# Altium project MultiPowerV2.PrjPcb
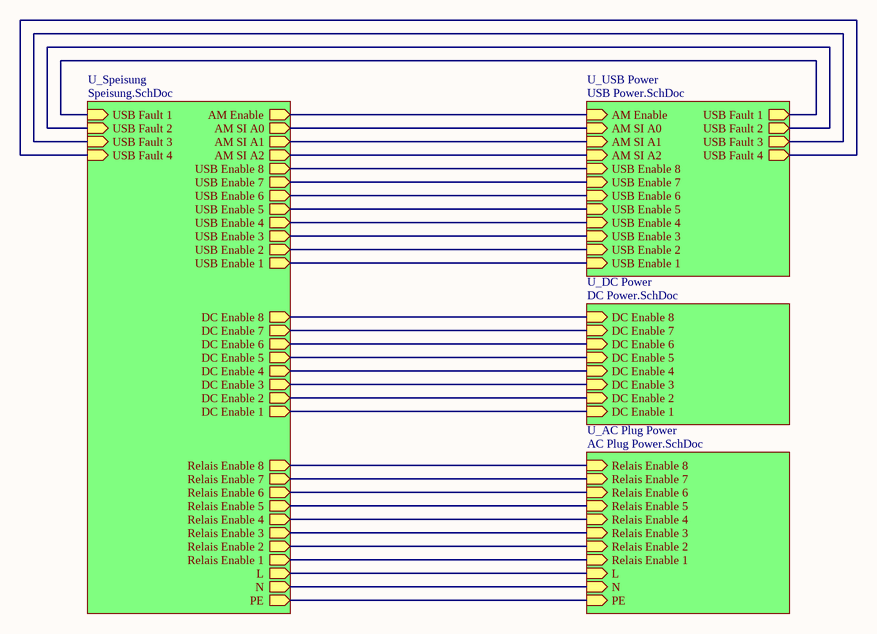
[diagram p0: Main.SchDoc]
5 sheets, 178 parts. Net scope: hierarchical (ports join the sheet entries above them; power ports are global).
Board file: MultiPower.PcbDoc
Sheets:
  Main.SchDoc
    U_Speisung = Speisung.SchDoc
    U_USB Power = USB Power.SchDoc
    U_DC Power = DC Power.SchDoc
    U_AC Plug Power = AC Plug Power.SchDoc

## Sheet Main.SchDoc
size A4; SheetNumber: 1; SheetTotal: 5

### Sub-sheets
U_AC Plug Power = AC Plug Power.SchDoc: Relais Enable 1 (in), Relais Enable 2 (in), Relais Enable 4 (in), Relais Enable 6 (in), Relais Enable 8 (in), Relais Enable 7 (in), Relais Enable 5 (in), Relais Enable 3 (in), L (in), N (in), PE (in)
U_DC Power = DC Power.SchDoc: DC Enable 5 (in), DC Enable 1 (in), DC Enable 2 (in), DC Enable 3 (in), DC Enable 4 (in), DC Enable 6 (in), DC Enable 7 (in), DC Enable 8 (in)
U_Speisung = Speisung.SchDoc: N (out), L (out), PE (out), DC Enable 8 (out), DC Enable 7 (out), DC Enable 6 (out), DC Enable 5 (out), DC Enable 4 (out), DC Enable 3 (out), DC Enable 2 (out), DC Enable 1 (out), Relais Enable 8 (out), Relais Enable 7 (out), Relais Enable 6 (out), Relais Enable 5 (out), Relais Enable 4 (out), Relais Enable 3 (out), Relais Enable 2 (out), Relais Enable 1 (out), USB Enable 8 (out), USB Enable 7 (out), USB Enable 6 (out), USB Enable 5 (out), USB Enable 4 (out), USB Enable 3 (out), USB Enable 2 (out), USB Enable 1 (out), USB Fault 4 (in), USB Fault 3 (in), USB Fault 2 (in), USB Fault 1 (in), AM SI A2 (out), AM SI A1 (out), AM SI A0 (out), AM Enable (out)
U_USB Power = USB Power.SchDoc: AM SI A0 (in), AM SI A1 (in), AM SI A2 (in), AM Enable (in), USB Fault 1 (out), USB Fault 3 (out), USB Fault 2 (out), USB Fault 4 (out), USB Enable 7 (in), USB Enable 3 (in), USB Enable 1 (in), USB Enable 8 (in), USB Enable 4 (in), USB Enable 2 (in), USB Enable 6 (in), USB Enable 5 (in)

### Nets
L: sheet U_Speisung/L, sheet U_AC Plug Power/L
N: sheet U_Speisung/N, sheet U_AC Plug Power/N
PE: sheet U_Speisung/PE, sheet U_AC Plug Power/PE
NetK1_4: sheet U_Speisung/USB Enable 8, sheet U_USB Power/USB Enable 8
NetK1_5: sheet U_Speisung/USB Enable 7, sheet U_USB Power/USB Enable 7
NetK1_6: sheet U_Speisung/USB Enable 6, sheet U_USB Power/USB Enable 6
NetK1_7: sheet U_Speisung/USB Enable 5, sheet U_USB Power/USB Enable 5
NetK1_8: sheet U_Speisung/USB Enable 4, sheet U_USB Power/USB Enable 4
NetK1_9: sheet U_Speisung/USB Enable 3, sheet U_USB Power/USB Enable 3
NetK1_10: sheet U_Speisung/USB Enable 2, sheet U_USB Power/USB Enable 2
NetK1_11: sheet U_Speisung/USB Enable 1, sheet U_USB Power/USB Enable 1
NetK1_13: sheet U_Speisung/USB Fault 4, sheet U_USB Power/USB Fault 4
NetK1_14: sheet U_Speisung/USB Fault 3, sheet U_USB Power/USB Fault 3
NetK1_15: sheet U_Speisung/USB Fault 2, sheet U_USB Power/USB Fault 2
NetK1_16: sheet U_Speisung/USB Fault 1, sheet U_USB Power/USB Fault 1
NetK1_17: sheet U_Speisung/AM SI A2, sheet U_USB Power/AM SI A2
NetK1_18: sheet U_Speisung/AM SI A1, sheet U_USB Power/AM SI A1
NetK1_19: sheet U_Speisung/AM SI A0, sheet U_USB Power/AM SI A0
NetK1_20: sheet U_Speisung/AM Enable, sheet U_USB Power/AM Enable
NetK2_4: sheet U_Speisung/DC Enable 8, sheet U_DC Power/DC Enable 8
NetK2_5: sheet U_Speisung/DC Enable 7, sheet U_DC Power/DC Enable 7
NetK2_6: sheet U_Speisung/DC Enable 6, sheet U_DC Power/DC Enable 6
NetK2_7: sheet U_Speisung/DC Enable 5, sheet U_DC Power/DC Enable 5
NetK2_8: sheet U_Speisung/DC Enable 4, sheet U_DC Power/DC Enable 4
NetK2_9: sheet U_Speisung/DC Enable 3, sheet U_DC Power/DC Enable 3
NetK2_10: sheet U_Speisung/DC Enable 2, sheet U_DC Power/DC Enable 2
NetK2_11: sheet U_Speisung/DC Enable 1, sheet U_DC Power/DC Enable 1
NetK2_13: sheet U_Speisung/Relais Enable 8, sheet U_AC Plug Power/Relais Enable 8
NetK2_14: sheet U_Speisung/Relais Enable 7, sheet U_AC Plug Power/Relais Enable 7
NetK2_15: sheet U_Speisung/Relais Enable 6, sheet U_AC Plug Power/Relais Enable 6
NetK2_16: sheet U_Speisung/Relais Enable 5, sheet U_AC Plug Power/Relais Enable 5
NetK2_17: sheet U_Speisung/Relais Enable 4, sheet U_AC Plug Power/Relais Enable 4
NetK2_18: sheet U_Speisung/Relais Enable 3, sheet U_AC Plug Power/Relais Enable 3
NetK2_19: sheet U_Speisung/Relais Enable 2, sheet U_AC Plug Power/Relais Enable 2
NetK2_20: sheet U_Speisung/Relais Enable 1, sheet U_AC Plug Power/Relais Enable 1

### Notes on the sheet
- Bahnhöheweg 70
- ICT Berufsbildungscenter AG
- Bereich Elektronik
- Datum:
- Version:
- Blattgrösse:
- Blattnummer:
- A4
- /
- 3018 Bern
- Dateiname:

## Sheet Speisung.SchDoc: Speisung
size A4; Author: bweina; CompanyName: ICT Bbc AG; DrawnBy: bweina; Engineer: bweina; Revision: 1.0.0; SheetNumber: 2; SheetTotal: 5
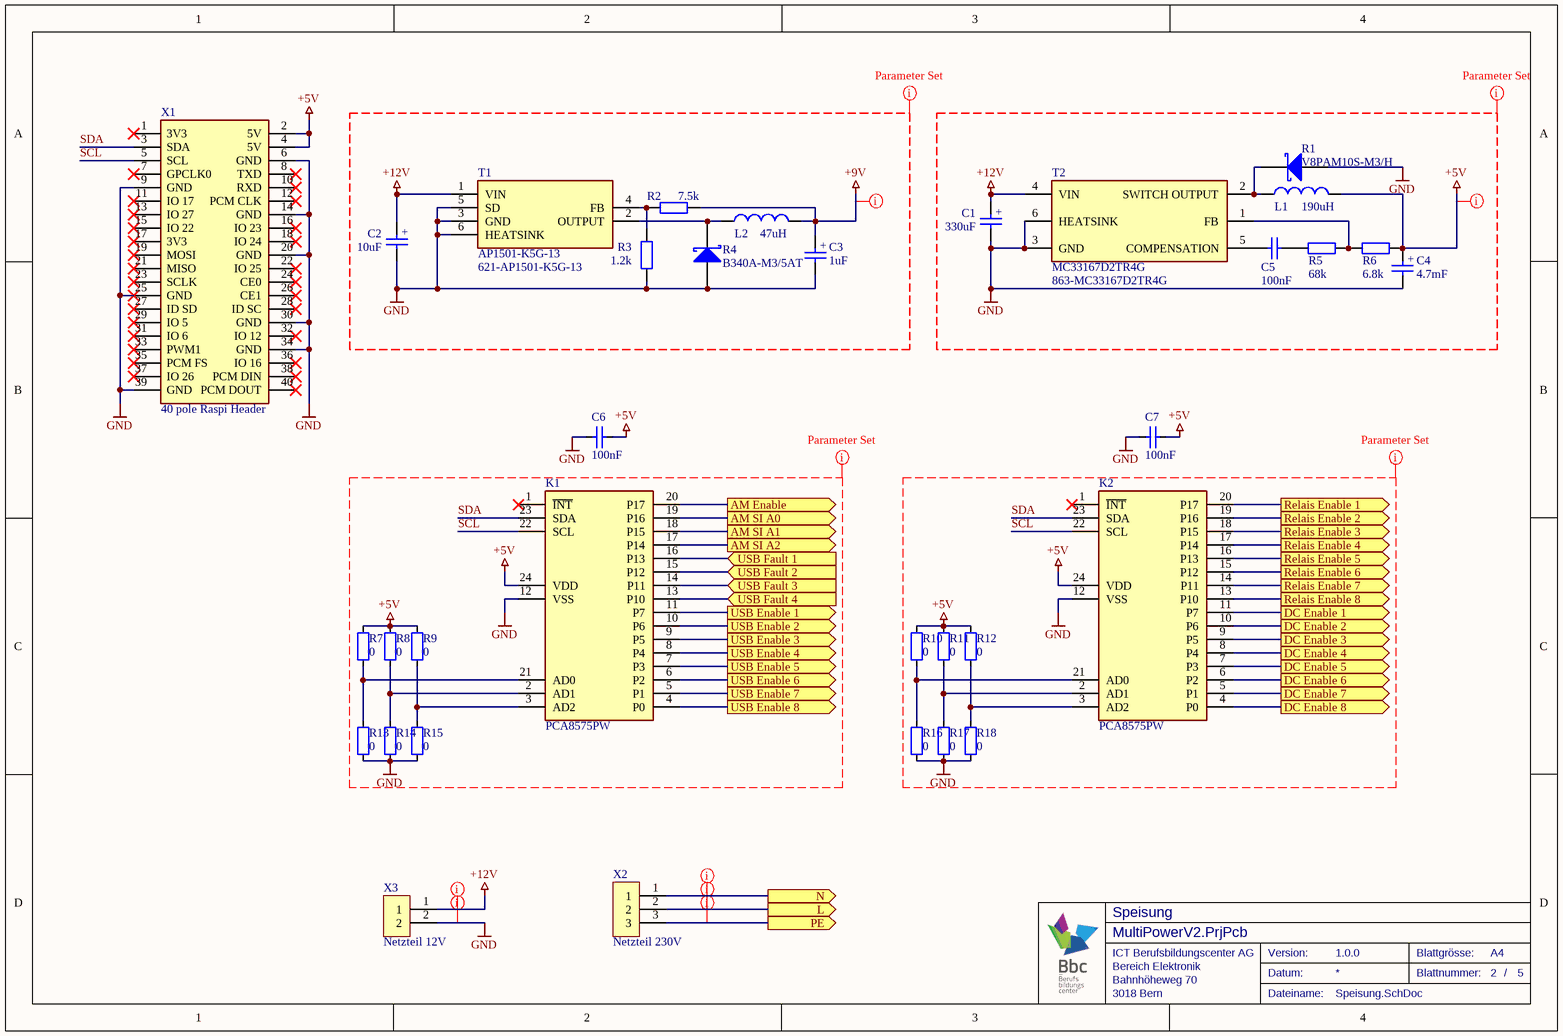
[diagram p1: Speisung.SchDoc]

### Parts
C1  value 330uF  [T521X337M016ATE015]  (hidden comment: Capacitor)
C2  value 10uF  [CAP TAN A R]  (hidden comment: Capacitor)
C3  value 1uF  [R82EC4100Z370J]  (hidden comment: Capacitor)
C4  value 4.7mF  [CAP ELKO 12.5x20x5 S]  (hidden comment: Capacitor)
C5  value 100nF  [CAP CER 1206 H]  (hidden comment: Capacitor)
C6  value 100nF  [CAP CER 0805 R]  (hidden comment: Capacitor)
C7  value 100nF  [CAP CER 0805 R]  (hidden comment: Capacitor)
K1  PCA8575PW  [TSOP65P640X110-24M]
K2  PCA8575PW  [TSOP65P640X110-24M]
L1  value 190uH  [SHBC14-1R2A0187V]  (hidden comment: Inductor)
L2  value 47uH  [SRP1038C6R8M]  (hidden comment: Inductor)
R1  V8PAM10S-M3/H  [DO-221BC]
R2  value 7.5k  [RESMELF3514N]  (hidden comment: Resistor)
R3  value 1.2k  [RESMELF3514N]  (hidden comment: Resistor)
R4  B340A-M3/5AT  [DO-214AC]
R5  value 68k  [RESMELF3514N]  (hidden comment: Resistor)
R6  value 6.8k  [RESMELF3514N]  (hidden comment: Resistor)
R7  value 0  [RES 1206 H]  (hidden comment: Resistor)
R8  value 0  [RES 1206 H]  (hidden comment: Resistor)
R9  value 0  [RES 1206 H]  (hidden comment: Resistor)
R10  value 0  [RES 1206 H]  (hidden comment: Resistor)
R11  value 0  [RES 1206 H]  (hidden comment: Resistor)
R12  value 0  [RES 1206 H]  (hidden comment: Resistor)
R13  value 0  [RES 1206 H]  (hidden comment: Resistor)
R14  value 0  [RES 1206 H]  (hidden comment: Resistor)
R15  value 0  [RES 1206 H]  (hidden comment: Resistor)
R16  value 0  [RES 1206 H]  (hidden comment: Resistor)
R17  value 0  [RES 1206 H]  (hidden comment: Resistor)
R18  value 0  [RES 1206 H]  (hidden comment: Resistor)
T1  AP1501-K5G-13  Supplier Part Number 1: 621-AP1501-K5G-13  [TO-263-5L]
T2  MC33167D2TR4G  Supplier Part Number 1: 863-MC33167D2TR4G  [TO-263-5]
X1  40 pole Raspi Header  [Header SMD Male 2x20 H]
X2  Netzteil 230V  [282841-3]
X3  Netzteil 12V  [282841-2]

### Ports
AM Enable (out), AM SI A0 (out), AM SI A1 (out), AM SI A2 (out), DC Enable 1 (out), DC Enable 2 (out), DC Enable 3 (out), DC Enable 4 (out), DC Enable 5 (out), DC Enable 6 (out), DC Enable 7 (out), DC Enable 8 (out), L (out), N (out), PE (out), Relais Enable 1 (out), Relais Enable 2 (out), Relais Enable 3 (out), Relais Enable 4 (out), Relais Enable 5 (out), Relais Enable 6 (out), Relais Enable 7 (out), Relais Enable 8 (out), USB Enable 1 (out), USB Enable 2 (out), USB Enable 3 (out), USB Enable 4 (out), USB Enable 5 (out), USB Enable 6 (out), USB Enable 7 (out), USB Enable 8 (out), USB Fault 1 (in), USB Fault 2 (in), USB Fault 3 (in), USB Fault 4 (in)

### Nets
+5V: C4.A(Anode) C6.2 C7.2 K1.24(VDD) K2.24(VDD) L1.2 R6.2 R7.2 R8.2 R9.2 R10.2 R11.2 R12.2 X1.2(5V) X1.4(5V)
+9V: C3.A(Anode) L2.2 R2.2
+12V: C1.A(Anode) C2.A(Anode) T1.1(VIN) T2.4(VIN) X3.1
GND: C1.C(Cathode) C2.C(Cathode) C3.C(Cathode) C4.C(Cathode) C6.1 C7.1 K1.12(VSS) K2.12(VSS) R1.A(Anode) R3.1 R4.A(Anode) R13.1 R14.1 R15.1 R16.1 R17.1 R18.1 T1.3(GND) T1.5(SD) T1.6(HEATSINK) T2.3(GND) T2.6(HEATSINK) X1.6(GND) X1.9(GND) X1.14(GND) X1.20(GND) X1.25(GND) X1.30(GND) X1.34(GND) X1.39(GND) X3.2
L: X2.2 ; port L
N: X2.1 ; port N
PE: X2.3 ; port PE
SCL: K1.22(SCL) K2.22(SCL) X1.5(SCL)
SDA: K1.23(SDA) K2.23(SDA) X1.3(SDA)
NetC5_1: C5.1 R5.1
NetC5_2: C5.2 T2.5(COMPENSATION)
NetK1_2: K1.2(AD1) R8.1 R14.2
NetK1_3: K1.3(AD2) R9.1 R15.2
NetK1_4: K1.4(P0) ; port USB Enable 8
NetK1_5: K1.5(P1) ; port USB Enable 7
NetK1_6: K1.6(P2) ; port USB Enable 6
NetK1_7: K1.7(P3) ; port USB Enable 5
NetK1_8: K1.8(P4) ; port USB Enable 4
NetK1_9: K1.9(P5) ; port USB Enable 3
NetK1_10: K1.10(P6) ; port USB Enable 2
NetK1_11: K1.11(P7) ; port USB Enable 1
NetK1_13: K1.13(P10) ; port USB Fault 4
NetK1_14: K1.14(P11) ; port USB Fault 3
NetK1_15: K1.15(P12) ; port USB Fault 2
NetK1_16: K1.16(P13) ; port USB Fault 1
NetK1_17: K1.17(P14) ; port AM SI A2
NetK1_18: K1.18(P15) ; port AM SI A1
NetK1_19: K1.19(P16) ; port AM SI A0
NetK1_20: K1.20(P17) ; port AM Enable
NetK1_21: K1.21(AD0) R7.1 R13.2
NetK2_2: K2.2(AD1) R11.1 R17.2
NetK2_3: K2.3(AD2) R12.1 R18.2
NetK2_4: K2.4(P0) ; port DC Enable 8
NetK2_5: K2.5(P1) ; port DC Enable 7
NetK2_6: K2.6(P2) ; port DC Enable 6
NetK2_7: K2.7(P3) ; port DC Enable 5
NetK2_8: K2.8(P4) ; port DC Enable 4
NetK2_9: K2.9(P5) ; port DC Enable 3
NetK2_10: K2.10(P6) ; port DC Enable 2
NetK2_11: K2.11(P7) ; port DC Enable 1
NetK2_13: K2.13(P10) ; port Relais Enable 8
NetK2_14: K2.14(P11) ; port Relais Enable 7
NetK2_15: K2.15(P12) ; port Relais Enable 6
NetK2_16: K2.16(P13) ; port Relais Enable 5
NetK2_17: K2.17(P14) ; port Relais Enable 4
NetK2_18: K2.18(P15) ; port Relais Enable 3
NetK2_19: K2.19(P16) ; port Relais Enable 2
NetK2_20: K2.20(P17) ; port Relais Enable 1
NetK2_21: K2.21(AD0) R10.1 R16.2
NetL1_1: L1.1 R1.C(Cathode) T2.2(SWITCH_OUTPUT)
NetL2_1: L2.1 R4.C(Cathode) T1.2(OUTPUT)
NetR2_1: R2.1 R3.2 T1.4(FB)
NetR5_2: R5.2 R6.1 T2.1(FB)

Not connected (* = marked no-connect by the designer): K1 1(~{INT})*; K2 1(~{INT})*; X1 1(3V3)* 7(GPCLK0)* 8(TXD)* 10(RXD)* 11(IO_17)* 12(PCM_CLK)* 13(IO_27)* 15(IO_22)* 16(IO_23)* 17(3V3)* 18(IO_24)* 19(MOSI)* 21(MISO)* 22(IO_25)* 23(SCLK)* 24(CE0)* 26(CE1)* 27(ID_SD)* 28(ID_SC)* 29(IO_5)* 31(IO_6)* 32(IO_12)* 33(PWM1)* 35(PCM_FS)* 36(IO_16)* 37(IO_26)* 38(PCM_DIN)* 40(PCM_DOUT)*

### Layout directives
net class POWER: +5V, +9V, +12V, GND, L, N, PE

### Notes on the sheet
- Bahnhöheweg 70
- ICT Berufsbildungscenter AG
- Bereich Elektronik
- Datum:
- Version:
- Blattgrösse:
- Blattnummer:
- A4
- /
- 3018 Bern
- Dateiname:
- (in symbol Capacitor P) +

### Library data of the parts
C1-C4 = Capacitor P: Polarized Capacitor; LatestRevisionDate: 02.04.2019; Publisher: ICT Berufsbildungscenter AG
C5-C7 = Capacitor: Non polarized capacitor; LatestRevisionDate: 01.04.2019; Publisher: ICT Berufsbildungscenter AG
L1 L2 = Inductor: Type: Typ; LatestRevisionDate: 05.04.2019; Publisher: ICT Berufsbildungscenter AG
R1 R4 = Schottky Diode: LatestRevisionDate: 03.04.2019; Publisher: ICT Berufsbildungscenter AG
T1 = AP1501-K5G-13: Switching Voltage Regulators; ComponentLink1Description: New link; ComponentLink1URL: https://www.mouser.ch/ProductDetail/Diodes-Incorporated/AP1501-K5G-13?qs=%2Fha2pyFaduh7%252BHz23V2KcD1UGDob8qiicWPpp%2F%2FWUHCQ5NeehxH4og%3D%3D; Supplier 1: Mouser
T2 = MC33167D2TR4G: Switching Voltage Regulators; Manufacturer_Name: ON Semiconductor; Datasheet Link: https://www.onsemi.com/pub/Collateral/MC34167-D.PDF; Manufacturer_Part_Number: MC33167D2TR4G; Mouser Part Number: 863-MC33167D2TR4G; Mouser Price/Stock: https://www.mouser.co.uk/ProductDetail/ON-Semiconductor/MC33167D2TR4G?qs=scuLso4UvAPiI8Zw378tbw%3D%3D; Arrow Part Number: MC33167D2TR4G; Arrow Price/Stock: https://www.arrow.com/en/products/mc33167d2tr4g/on-semiconductor; Supplier 1: Mouser
X1 = RaspberryHeader40: board to board header; LatestRevisionDate: 02.05.2019; Publisher: ICT Berufsbildungscenter AG
X2 = Header 3: board to board header; LatestRevisionDate: 02.05.2019; Publisher: ICT Berufsbildungscenter AG
X3 = Header 2: board to board header; LatestRevisionDate: 02.05.2019; Publisher: ICT Berufsbildungscenter AG
R2 R3 R5-R18 = Resistor: LatestRevisionDate: 02.04.2019; Publisher: ICT Berufsbildungscenter AG

## Sheet USB Power.SchDoc
size A4; SheetNumber: 3; SheetTotal: 5
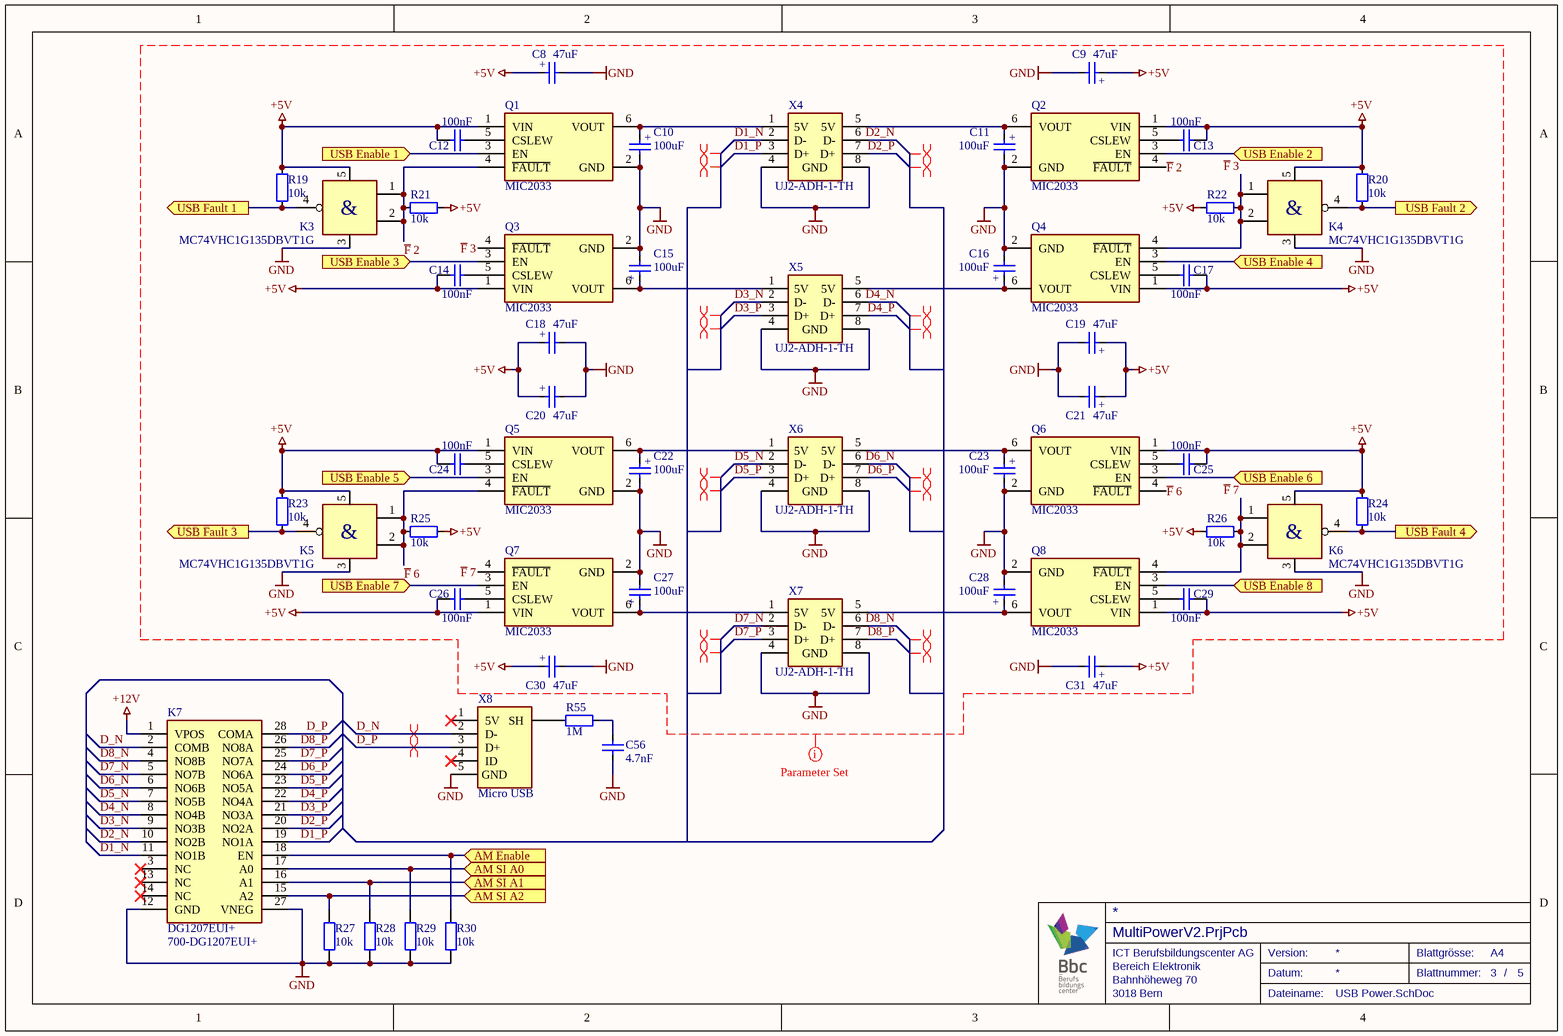
[diagram p2: USB Power.SchDoc]

### Parts
C8  value 47uF  [T58W9476M6R3C0300]  (hidden comment: Capacitor P)
C9  value 47uF  [T58W9476M6R3C0300]  (hidden comment: Capacitor P)
C10  value 100uF  [CAP TAN A H]  (hidden comment: Capacitor P)
C11  value 100uF  [CAP TAN A H]  (hidden comment: Capacitor P)
C12  value 100nF  [CAP CER 0805 R]  (hidden comment: Capacitor)
C13  value 100nF  [CAP CER 0805 R]  (hidden comment: Capacitor)
C14  value 100nF  [CAP CER 0805 R]  (hidden comment: Capacitor)
C15  value 100uF  [CAP TAN A H]  (hidden comment: Capacitor P)
C16  value 100uF  [CAP TAN A H]  (hidden comment: Capacitor P)
C17  value 100nF  [CAP CER 0805 R]  (hidden comment: Capacitor)
C18  value 47uF  [T58W9476M6R3C0300]  (hidden comment: Capacitor P)
C19  value 47uF  [T58W9476M6R3C0300]  (hidden comment: Capacitor P)
C20  value 47uF  [T58W9476M6R3C0300]  (hidden comment: Capacitor P)
C21  value 47uF  [T58W9476M6R3C0300]  (hidden comment: Capacitor P)
C22  value 100uF  [CAP TAN A H]  (hidden comment: Capacitor P)
C23  value 100uF  [CAP TAN A H]  (hidden comment: Capacitor P)
C24  value 100nF  [CAP CER 0805 R]  (hidden comment: Capacitor)
C25  value 100nF  [CAP CER 0805 R]  (hidden comment: Capacitor)
C26  value 100nF  [CAP CER 0805 R]  (hidden comment: Capacitor)
C27  value 100uF  [CAP TAN A H]  (hidden comment: Capacitor P)
C28  value 100uF  [CAP TAN A H]  (hidden comment: Capacitor P)
C29  value 100nF  [CAP CER 0805 R]  (hidden comment: Capacitor)
C30  value 47uF  [T58W9476M6R3C0300]  (hidden comment: Capacitor P)
C31  value 47uF  [T58W9476M6R3C0300]  (hidden comment: Capacitor P)
C56  value 4.7nF  [CAP CER 0805 R]  (hidden comment: Capacitor)
K3  MC74VHC1G135DBVT1G  [SOT95P275X110-5N]
K4  MC74VHC1G135DBVT1G  [SOT95P275X110-5N]
K5  MC74VHC1G135DBVT1G  [SOT95P275X110-5N]
K6  MC74VHC1G135DBVT1G  [SOT95P275X110-5N]
K7  DG1207EUI+  Supplier Part Number 1: 700-DG1207EUI+  [TSOP65P640X100-28N]
Q1  MIC2033  [SOT-23-6L]
Q2  MIC2033  [SOT-23-6L]
Q3  MIC2033  [SOT-23-6L]
Q4  MIC2033  [SOT-23-6L]
Q5  MIC2033  [SOT-23-6L]
Q6  MIC2033  [SOT-23-6L]
Q7  MIC2033  [SOT-23-6L]
Q8  MIC2033  [SOT-23-6L]
R19  value 10k  [RES 0805 R]  (hidden comment: Resistor)
R20  value 10k  [RES 0805 R]  (hidden comment: Resistor)
R21  value 10k  [RES 0805 R]  (hidden comment: Resistor)
R22  value 10k  [RES 0805 R]  (hidden comment: Resistor)
R23  value 10k  [RES 0805 R]  (hidden comment: Resistor)
R24  value 10k  [RES 0805 R]  (hidden comment: Resistor)
R25  value 10k  [RES 0805 R]  (hidden comment: Resistor)
R26  value 10k  [RES 0805 R]  (hidden comment: Resistor)
R27  value 10k  [RES 0805 R]  (hidden comment: Resistor)
R28  value 10k  [RES 0805 R]  (hidden comment: Resistor)
R29  value 10k  [RES 0805 R]  (hidden comment: Resistor)
R30  value 10k  [RES 0805 R]  (hidden comment: Resistor)
R55  value 1M  [RES 0805 R]  (hidden comment: Resistor)
X4  UJ2-ADH-1-TH  [UJ2-ADH-1-TH]
X5  UJ2-ADH-1-TH  [UJ2-ADH-1-TH]
X6  UJ2-ADH-1-TH  [UJ2-ADH-1-TH]
X7  UJ2-ADH-1-TH  [UJ2-ADH-1-TH]
X8  Micro USB  [UJ2-MIBH-4-SMT-TR]

### Ports
AM Enable (in), AM SI A0 (in), AM SI A1 (in), AM SI A2 (in), USB Enable 1 (in), USB Enable 2 (in), USB Enable 3 (in), USB Enable 4 (in), USB Enable 5 (in), USB Enable 6 (in), USB Enable 7 (in), USB Enable 8 (in), USB Fault 1 (out), USB Fault 2 (out), USB Fault 3 (out), USB Fault 4 (out)

### Nets
+5V: C8.A(Anode) C9.A(Anode) C12.1 C13.1 C14.1 C17.1 C18.A(Anode) C19.A(Anode) C20.A(Anode) C21.A(Anode) C24.1 C25.1 C26.1 C29.1 C30.A(Anode) C31.A(Anode) K3.5(VCC) K4.5(VCC) K5.5(VCC) K6.5(VCC) Q1.1(VIN) Q2.1(VIN) Q3.1(VIN) Q4.1(VIN) Q5.1(VIN) Q6.1(VIN) Q7.1(VIN) Q8.1(VIN) R19.1 R20.1 R21.1 R22.1 R23.1 R24.1 R25.1 R26.1
+12V: K7.1(VPOS)
GND: C8.C(Cathode) C9.C(Cathode) C10.C(Cathode) C11.C(Cathode) C15.C(Cathode) C16.C(Cathode) C18.C(Cathode) C19.C(Cathode) C20.C(Cathode) C21.C(Cathode) C22.C(Cathode) C23.C(Cathode) C27.C(Cathode) C28.C(Cathode) C30.C(Cathode) C31.C(Cathode) C56.1 K3.3(GND) K4.3(GND) K5.3(GND) K6.3(GND) K7.12(GND) K7.27(VNEG) Q1.2(GND) Q2.2(GND) Q3.2(GND) Q4.2(GND) Q5.2(GND) Q6.2(GND) Q7.2(GND) Q8.2(GND) R27.1 R28.1 R29.1 R30.1 X4.4(GND) X4.8(GND) X5.4(GND) X5.8(GND) X6.4(GND) X6.8(GND) X7.4(GND) X7.8(GND) X8.5(GND)
D1_N: K7.11(NO1B) X4.2(D-)
D1_P: K7.19(NO1A) X4.3(D+)
D2_N: K7.10(NO2B) X4.6(D-)
D2_P: K7.20(NO2A) X4.7(D+)
D3_N: K7.9(NO3B) X5.2(D-)
D3_P: K7.21(NO3A) X5.3(D+)
D4_N: K7.8(NO4B) X5.6(D-)
D4_P: K7.22(NO4A) X5.7(D+)
D5_N: K7.7(NO5B) X6.2(D-)
D5_P: K7.23(NO5A) X6.3(D+)
D6_N: K7.6(NO6B) X6.6(D-)
D6_P: K7.24(NO6A) X6.7(D+)
D7_N: K7.5(NO7B) X7.2(D-)
D7_P: K7.25(NO7A) X7.3(D+)
D8_N: K7.4(NO8B) X7.6(D-)
D8_P: K7.26(NO8A) X7.7(D+)
D_N: K7.2(COMB) X8.2(D-)
D_P: K7.28(COMA) X8.3(D+)
~{F} 2: K3.1(A) K3.2(B) Q1.4(~{FAULT}) Q2.4(~{FAULT}) R21.2
~{F} 3: K4.1(A) K4.2(B) Q3.4(~{FAULT}) Q4.4(~{FAULT}) R22.2
~{F} 6: K5.1(A) K5.2(B) Q5.4(~{FAULT}) Q6.4(~{FAULT}) R25.2
~{F} 7: K6.1(A) K6.2(B) Q7.4(~{FAULT}) Q8.4(~{FAULT}) R26.2
NetC10_A: C10.A(Anode) Q1.6(VOUT) X4.1(5V)
NetC11_A: C11.A(Anode) Q2.6(VOUT) X4.5(5V)
NetC12_2: C12.2 Q1.5(CSLEW)
NetC13_2: C13.2 Q2.5(CSLEW)
NetC14_2: C14.2 Q3.5(CSLEW)
NetC15_A: C15.A(Anode) Q3.6(VOUT) X5.1(5V)
NetC16_A: C16.A(Anode) Q4.6(VOUT) X5.5(5V)
NetC17_2: C17.2 Q4.5(CSLEW)
NetC22_A: C22.A(Anode) Q5.6(VOUT) X6.1(5V)
NetC23_A: C23.A(Anode) Q6.6(VOUT) X6.5(5V)
NetC24_2: C24.2 Q5.5(CSLEW)
NetC25_2: C25.2 Q6.5(CSLEW)
NetC26_2: C26.2 Q7.5(CSLEW)
NetC27_A: C27.A(Anode) Q7.6(VOUT) X7.1(5V)
NetC28_A: C28.A(Anode) Q8.6(VOUT) X7.5(5V)
NetC29_2: C29.2 Q8.5(CSLEW)
NetC56_2: C56.2 R55.1
NetK1_4: Q8.3(EN) ; port USB Enable 8
NetK1_5: Q7.3(EN) ; port USB Enable 7
NetK1_6: Q6.3(EN) ; port USB Enable 6
NetK1_7: Q5.3(EN) ; port USB Enable 5
NetK1_8: Q4.3(EN) ; port USB Enable 4
NetK1_9: Q3.3(EN) ; port USB Enable 3
NetK1_10: Q2.3(EN) ; port USB Enable 2
NetK1_11: Q1.3(EN) ; port USB Enable 1
NetK1_13: K6.4(Y) R24.2 ; port USB Fault 4
NetK1_14: K5.4(Y) R23.2 ; port USB Fault 3
NetK1_15: K4.4(Y) R20.2 ; port USB Fault 2
NetK1_16: K3.4(Y) R19.2 ; port USB Fault 1
NetK1_17: K7.15(A2) R27.2 ; port AM SI A2
NetK1_18: K7.16(A1) R28.2 ; port AM SI A1
NetK1_19: K7.17(A0) R29.2 ; port AM SI A0
NetK1_20: K7.18(EN) R30.2 ; port AM Enable
NetR55_2: R55.2 X8.SH

Not connected (* = marked no-connect by the designer): K7 3(NC)* 13(NC)* 14(NC)*; X8 1(5V)* 4(ID)*

### Layout directives
differential pair: +5V, D1_N, D1_P, D2_N, D2_P, D3_N, D3_P, D4_N, D4_P, D5_N, D5_P, D6_N, D6_P, D7_N, D7_P, D8_N, D8_P, D_N, D_P, GND, ~{F} 2, ~{F} 3, ~{F} 6, ~{F} 7

### Notes on the sheet
- Bahnhöheweg 70
- ICT Berufsbildungscenter AG
- Bereich Elektronik
- Datum:
- Version:
- Blattgrösse:
- Blattnummer:
- A4
- /
- 3018 Bern
- Dateiname:
- (in symbol Capacitor P) +
- (in symbol MC74VHC1G135DBVT1G) &

### Library data of the parts
C8-C11 C15 C16 C18-C23 C27 C28 C30 C31 = Capacitor P: Polarized Capacitor; LatestRevisionDate: 02.04.2019; Publisher: ICT Berufsbildungscenter AG
C12-C14 C17 C24-C26 C29 C56 = Capacitor: Non polarized capacitor; LatestRevisionDate: 01.04.2019; Publisher: ICT Berufsbildungscenter AG
K7 = DG1207EUI+: Analog Switch ICs; Manufacturer_Name: Maxim Integrated; Datasheet Link: https://datasheets.maximintegrated.com/en/ds/DG1206-DG1207.pdf; Height: 1.1mm; Manufacturer_Part_Number: DG1207EUI+; Mouser Part Number: 700-DG1207EUI+; Mouser Price/Stock: https://www.mouser.co.uk/ProductDetail/Maxim-Integrated/DG1207EUI%2b?qs=DPoM0jnrROX2%252BoIpSyCc8Q%3D%3D; ComponentLink1Description: New link; ComponentLink1URL: https://www.mouser.ch/ProductDetail/Maxim-Integrated/DG1207EUI%2b?qs=DPoM0jnrROX2%252BoIpSyCc8Q%3D%3D; Supplier 1: Mouser
X4-X7 = UJ2-ADH-1-TH: USB Type A; Manufacturer_Name: CUI Inc.; Datasheet Link: http://www.cui.com/product/resource/uj2-adh-th.pdf; Manufacturer_Part_Number: UJ2-ADH-1-TH; Mouser Part Number: 490-UJ2-ADH-1-TH; Mouser Price/Stock: https://www.mouser.co.uk/ProductDetail/CUI-Devices/UJ2-ADH-1-TH/?qs=5mqXD9RfOg1bQeR60A16hA%3D%3D; Arrow Part Number: UJ2-ADH-1-TH; Arrow Price/Stock: https://www.arrow.com/en/products/uj2-adh-1-th/cui-devices
X8 = Micro USB: board to board header; LatestRevisionDate: 02.05.2019; Publisher: ICT Berufsbildungscenter AG
Q1-Q8 = MIC2033: ComponentLink1Description: New link; ComponentLink1URL: https://www.mouser.ch/ProductDetail/Microchip-Technology-Micrel/MIC2033-10AYM6-TR?qs=Y3Q3JoKAO1RvbLJdilrfXQ%3D%3D
R19-R30 R55 = Resistor: LatestRevisionDate: 02.04.2019; Publisher: ICT Berufsbildungscenter AG

## Sheet DC Power.SchDoc
size A4; SheetNumber: 4; SheetTotal: 5
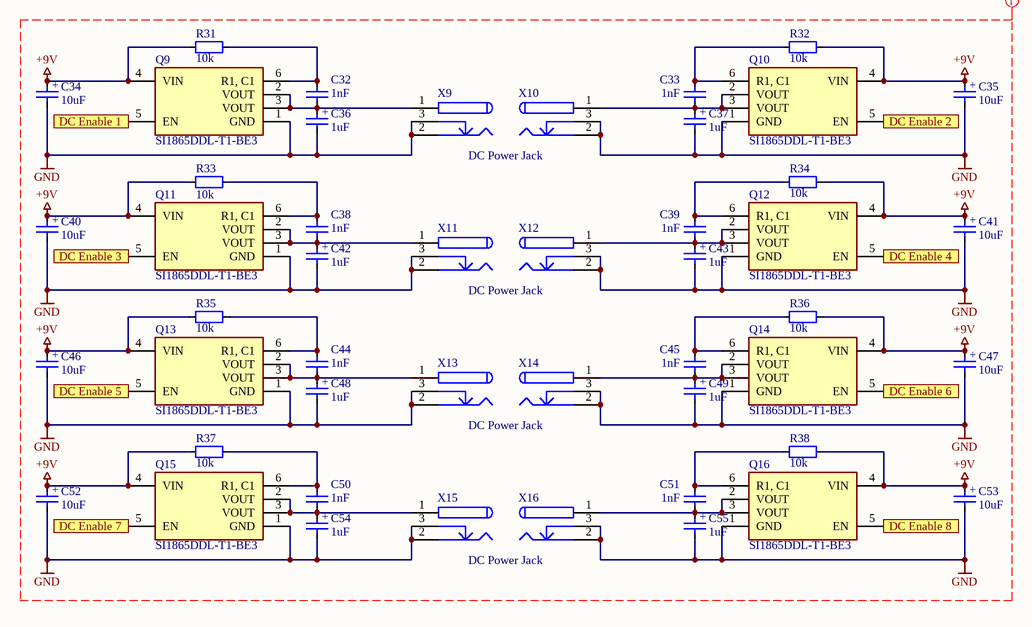
[diagram p3: DC Power.SchDoc]

### Parts
C32  value 1nF  [CAP CER 0805 H]  (hidden comment: Capacitor)
C33  value 1nF  [CAP CER 0805 H]  (hidden comment: Capacitor)
C34  value 10uF  [CAP TAN A R]  (hidden comment: Capacitor P)
C35  value 10uF  [CAP TAN A R]  (hidden comment: Capacitor P)
C36  value 1uF  [CAP TAN A R]  (hidden comment: Capacitor P)
C37  value 1uF  [CAP TAN A R]  (hidden comment: Capacitor P)
C38  value 1nF  [CAP CER 0805 H]  (hidden comment: Capacitor)
C39  value 1nF  [CAP CER 0805 H]  (hidden comment: Capacitor)
C40  value 10uF  [CAP TAN A R]  (hidden comment: Capacitor P)
C41  value 10uF  [CAP TAN A R]  (hidden comment: Capacitor P)
C42  value 1uF  [CAP TAN A R]  (hidden comment: Capacitor P)
C43  value 1uF  [CAP TAN A R]  (hidden comment: Capacitor P)
C44  value 1nF  [CAP CER 0805 H]  (hidden comment: Capacitor)
C45  value 1nF  [CAP CER 0805 H]  (hidden comment: Capacitor)
C46  value 10uF  [CAP TAN A R]  (hidden comment: Capacitor P)
C47  value 10uF  [CAP TAN A R]  (hidden comment: Capacitor P)
C48  value 1uF  [CAP TAN A R]  (hidden comment: Capacitor P)
C49  value 1uF  [CAP TAN A R]  (hidden comment: Capacitor P)
C50  value 1nF  [CAP CER 0805 H]  (hidden comment: Capacitor)
C51  value 1nF  [CAP CER 0805 H]  (hidden comment: Capacitor)
C52  value 10uF  [CAP TAN A R]  (hidden comment: Capacitor P)
C53  value 10uF  [CAP TAN A R]  (hidden comment: Capacitor P)
C54  value 1uF  [CAP TAN A R]  (hidden comment: Capacitor P)
C55  value 1uF  [CAP TAN A R]  (hidden comment: Capacitor P)
Q9  SI1865DDL-T1-BE3  [SOT-363]
Q10  SI1865DDL-T1-BE3  [SOT-363]
Q11  SI1865DDL-T1-BE3  [SOT-363]
Q12  SI1865DDL-T1-BE3  [SOT-363]
Q13  SI1865DDL-T1-BE3  [SOT-363]
Q14  SI1865DDL-T1-BE3  [SOT-363]
Q15  SI1865DDL-T1-BE3  [SOT-363]
Q16  SI1865DDL-T1-BE3  [SOT-363]
R31  value 10k  [RESMELF3514N]  (hidden comment: Resistor)
R32  value 10k  [RESMELF3514N]  (hidden comment: Resistor)
R33  value 10k  [RESMELF3514N]  (hidden comment: Resistor)
R34  value 10k  [RESMELF3514N]  (hidden comment: Resistor)
R35  value 10k  [RESMELF3514N]  (hidden comment: Resistor)
R36  value 10k  [RESMELF3514N]  (hidden comment: Resistor)
R37  value 10k  [RESMELF3514N]  (hidden comment: Resistor)
R38  value 10k  [RESMELF3514N]  (hidden comment: Resistor)
X9  DC Power Jack  [282841-3]
X10  DC Power Jack  [282841-3]  (value not drawn)
X11  DC Power Jack  [282841-3]
X12  DC Power Jack  [282841-3]  (value not drawn)
X13  DC Power Jack  [282841-3]
X14  DC Power Jack  [282841-3]  (value not drawn)
X15  DC Power Jack  [282841-3]
X16  DC Power Jack  [282841-3]  (value not drawn)

### Ports
DC Enable 1 (in), DC Enable 2 (in), DC Enable 3 (in), DC Enable 4 (in), DC Enable 5 (in), DC Enable 6 (in), DC Enable 7 (in), DC Enable 8 (in)

### Nets
+9V: C34.A(Anode) C35.A(Anode) C40.A(Anode) C41.A(Anode) C46.A(Anode) C47.A(Anode) C52.A(Anode) C53.A(Anode) Q9.4(VIN) Q10.4(VIN) Q11.4(VIN) Q12.4(VIN) Q13.4(VIN) Q14.4(VIN) Q15.4(VIN) Q16.4(VIN) R31.2 R32.2 R33.2 R34.1 R35.2 R36.1 R37.2 R38.1
GND: C34.C(Cathode) C35.C(Cathode) C36.C(Cathode) C37.C(Cathode) C40.C(Cathode) C41.C(Cathode) C42.C(Cathode) C43.C(Cathode) C46.C(Cathode) C47.C(Cathode) C48.C(Cathode) C49.C(Cathode) C52.C(Cathode) C53.C(Cathode) C54.C(Cathode) C55.C(Cathode) Q9.1(GND) Q10.1(GND) Q11.1(GND) Q12.1(GND) Q13.1(GND) Q14.1(GND) Q15.1(GND) Q16.1(GND) X9.2 X9.3 X10.2 X10.3 X11.2 X11.3 X12.2 X12.3 X13.2 X13.3 X14.2 X14.3 X15.2 X15.3 X16.2 X16.3
NetC32_1: C32.1 C36.A(Anode) Q9.2(VOUT) Q9.3(VOUT) X9.1
NetC32_2: C32.2 Q9.6(R1,_C1) R31.1
NetC33_1: C33.1 C37.A(Anode) Q10.2(VOUT) Q10.3(VOUT) X10.1
NetC33_2: C33.2 Q10.6(R1,_C1) R32.1
NetC38_1: C38.1 C42.A(Anode) Q11.2(VOUT) Q11.3(VOUT) X11.1
NetC38_2: C38.2 Q11.6(R1,_C1) R33.1
NetC39_1: C39.1 C43.A(Anode) Q12.2(VOUT) Q12.3(VOUT) X12.1
NetC39_2: C39.2 Q12.6(R1,_C1) R34.2
NetC44_1: C44.1 C48.A(Anode) Q13.2(VOUT) Q13.3(VOUT) X13.1
NetC44_2: C44.2 Q13.6(R1,_C1) R35.1
NetC45_1: C45.1 C49.A(Anode) Q14.2(VOUT) Q14.3(VOUT) X14.1
NetC45_2: C45.2 Q14.6(R1,_C1) R36.2
NetC50_1: C50.1 C54.A(Anode) Q15.2(VOUT) Q15.3(VOUT) X15.1
NetC50_2: C50.2 Q15.6(R1,_C1) R37.1
NetC51_1: C51.1 C55.A(Anode) Q16.2(VOUT) Q16.3(VOUT) X16.1
NetC51_2: C51.2 Q16.6(R1,_C1) R38.2
NetK2_4: Q16.5(EN) ; port DC Enable 8
NetK2_5: Q15.5(EN) ; port DC Enable 7
NetK2_6: Q14.5(EN) ; port DC Enable 6
NetK2_7: Q13.5(EN) ; port DC Enable 5
NetK2_8: Q12.5(EN) ; port DC Enable 4
NetK2_9: Q11.5(EN) ; port DC Enable 3
NetK2_10: Q10.5(EN) ; port DC Enable 2
NetK2_11: Q9.5(EN) ; port DC Enable 1

### Notes on the sheet
- Bahnhöheweg 70
- ICT Berufsbildungscenter AG
- Bereich Elektronik
- Datum:
- Version:
- Blattgrösse:
- Blattnummer:
- A4
- /
- 3018 Bern
- Dateiname:
- (in symbol Capacitor P) +

### Library data of the parts
C32 C33 C38 C39 C44 C45 C50 C51 = Capacitor: Non polarized capacitor; LatestRevisionDate: 01.04.2019; Publisher: ICT Berufsbildungscenter AG
C34-C37 C40-C43 C46-C49 C52-C55 = Capacitor P: Polarized Capacitor; LatestRevisionDate: 02.04.2019; Publisher: ICT Berufsbildungscenter AG
X9-X16 = DC Power Jack: DC Power Jack 9V
R31-R38 = Resistor: LatestRevisionDate: 02.04.2019; Publisher: ICT Berufsbildungscenter AG

## Sheet AC Plug Power.SchDoc
size A4; SheetNumber: 5; SheetTotal: 5
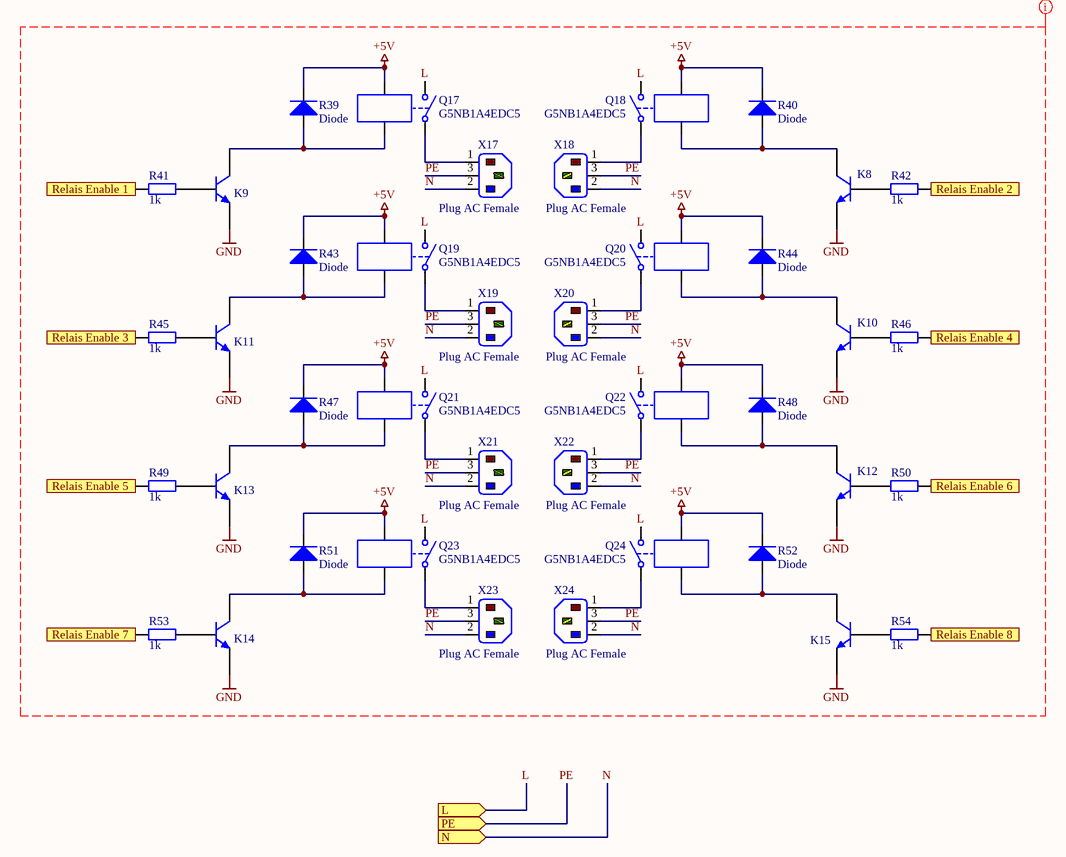
[diagram p4: AC Plug Power.SchDoc]

### Parts
K8  BC817-16-7-F  [SOT23-3]  (value not drawn)
K9  BC817-16-7-F  [SOT23-3]  (value not drawn)
K10  BC817-16-7-F  [SOT23-3]  (value not drawn)
K11  BC817-16-7-F  [SOT23-3]  (value not drawn)
K12  BC817-16-7-F  [SOT23-3]  (value not drawn)
K13  BC817-16-7-F  [SOT23-3]  (value not drawn)
K14  BC817-16-7-F  [SOT23-3]  (value not drawn)
K15  BC817-16-7-F  [SOT23-3]  (value not drawn)
Q17  G5NB1A4EDC5  [G5NB1A4DC5]
Q18  G5NB1A4EDC5  [G5NB1A4DC5]
Q19  G5NB1A4EDC5  [G5NB1A4DC5]
Q20  G5NB1A4EDC5  [G5NB1A4DC5]
Q21  G5NB1A4EDC5  [G5NB1A4DC5]
Q22  G5NB1A4EDC5  [G5NB1A4DC5]
Q23  G5NB1A4EDC5  [G5NB1A4DC5]
Q24  G5NB1A4EDC5  [G5NB1A4DC5]
R39  Diode  [DIOMELF3515N]
R40  Diode  [DIOMELF3515N]
R41  value 1k  [RESMELF3514N]  (hidden comment: Resistor)
R42  value 1k  [RESMELF3514N]  (hidden comment: Resistor)
R43  Diode  [DIOMELF3515N]
R44  Diode  [DIOMELF3515N]
R45  value 1k  [RESMELF3514N]  (hidden comment: Resistor)
R46  value 1k  [RESMELF3514N]  (hidden comment: Resistor)
R47  Diode  [DIOMELF3515N]
R48  Diode  [DIOMELF3515N]
R49  value 1k  [RESMELF3514N]  (hidden comment: Resistor)
R50  value 1k  [RESMELF3514N]  (hidden comment: Resistor)
R51  Diode  [DIOMELF3515N]
R52  Diode  [DIOMELF3515N]
R53  value 1k  [RESMELF3514N]  (hidden comment: Resistor)
R54  value 1k  [RESMELF3514N]  (hidden comment: Resistor)
X17  Plug AC Female  [282841-3]
X18  Plug AC Female  [282841-3]
X19  Plug AC Female  [282841-3]
X20  Plug AC Female  [282841-3]
X21  Plug AC Female  [282841-3]
X22  Plug AC Female  [282841-3]
X23  Plug AC Female  [282841-3]
X24  Plug AC Female  [282841-3]

### Ports
L (in), N (in), PE (in), Relais Enable 1 (in), Relais Enable 2 (in), Relais Enable 3 (in), Relais Enable 4 (in), Relais Enable 5 (in), Relais Enable 6 (in), Relais Enable 7 (in), Relais Enable 8 (in)

### Nets
+5V: Q17.4 Q18.4 Q19.4 Q20.4 Q21.4 Q22.4 Q23.4 Q24.4 R39.C(Cathode) R40.C(Cathode) R43.C(Cathode) R44.C(Cathode) R47.C(Cathode) R48.C(Cathode) R51.C(Cathode) R52.C(Cathode)
GND: K8.2(E) K9.2(E) K10.2(E) K11.2(E) K12.2(E) K13.2(E) K14.2(E) K15.2(E)
L: Q17.2 Q18.2 Q19.2 Q20.2 Q21.2 Q22.2 Q23.2 Q24.2 ; port L
N: X17.2(N) X18.2(N) X19.2(N) X20.2(N) X21.2(N) X22.2(N) X23.2(N) X24.2(N) ; port N
PE: X17.3(E) X18.3(E) X19.3(E) X20.3(E) X21.3(E) X22.3(E) X23.3(E) X24.3(E) ; port PE
NetK2_13: R54.2 ; port Relais Enable 8
NetK2_14: R53.1 ; port Relais Enable 7
NetK2_15: R50.2 ; port Relais Enable 6
NetK2_16: R49.1 ; port Relais Enable 5
NetK2_17: R46.2 ; port Relais Enable 4
NetK2_18: R45.1 ; port Relais Enable 3
NetK2_19: R42.2 ; port Relais Enable 2
NetK2_20: R41.1 ; port Relais Enable 1
NetK8_1: K8.1(B) R42.1
NetK8_3: K8.3(C) Q18.3 R40.A(Anode)
NetK9_1: K9.1(B) R41.2
NetK9_3: K9.3(C) Q17.3 R39.A(Anode)
NetK10_1: K10.1(B) R46.1
NetK10_3: K10.3(C) Q20.3 R44.A(Anode)
NetK11_1: K11.1(B) R45.2
NetK11_3: K11.3(C) Q19.3 R43.A(Anode)
NetK12_1: K12.1(B) R50.1
NetK12_3: K12.3(C) Q22.3 R48.A(Anode)
NetK13_1: K13.1(B) R49.2
NetK13_3: K13.3(C) Q21.3 R47.A(Anode)
NetK14_1: K14.1(B) R53.2
NetK14_3: K14.3(C) Q23.3 R51.A(Anode)
NetK15_1: K15.1(B) R54.1
NetK15_3: K15.3(C) Q24.3 R52.A(Anode)
NetQ17_1: Q17.1 X17.1(L)
NetQ18_1: Q18.1 X18.1(L)
NetQ19_1: Q19.1 X19.1(L)
NetQ20_1: Q20.1 X20.1(L)
NetQ21_1: Q21.1 X21.1(L)
NetQ22_1: Q22.1 X22.1(L)
NetQ23_1: Q23.1 X23.1(L)
NetQ24_1: Q24.1 X24.1(L)

### Notes on the sheet
- Bahnhöheweg 70
- ICT Berufsbildungscenter AG
- Bereich Elektronik
- Datum:
- Version:
- Blattgrösse:
- Blattnummer:
- A4
- /
- 3018 Bern
- Dateiname:

### Library data of the parts
K8-K15 = BC817-16-7-F: Transistor NPN in SOT23-3 package; Supplier 1: Mouser; Supplier Part Number 1: 621-BC817-16-7-F
Q17-Q24 = Relay-SPST: Single-Pole Single-Throw Relay; Published: 24-Mar-1999; LatestRevisionDate: 17-Jul-2002; LatestRevisionNote: Re-released for DXP Platform.; PackageReference: MODULE4; Publisher: Altium Limited
X17-X24 = Plug AC Male: IEC Mains Power Inlet, EN60 320-1 C14 Class I Cold Condition, PC Flange Rear Mount, Chassis Plug; PackageDocument: ver.80, 15-Sep-2003; MaximumRating: 10A, 250V a.c. (UL & CSA 15A, 250V a.c.); MountingFixtures: Not drawn on schematic symbol.; PCB_Layout: Complies with manufacturer's recommendation.; DrillSize: Corresponds to nominal value.; Note: IEC Color Scheme employed for L, N and E.; Published: 15-Jul-2004; LatestRevisionDate: 15-Jul-2004; LatestRevisionNote: Component Replaced.; DatasheetDocument: ver.80, 15-Sep-2003; PackageReference: PX0580/PC; Publisher: Altium Limited; Terminations: P.C. Spills; ComponentLink1Description: Manufacturer Link; ComponentLink1URL: http://www.bulgin.co.uk/
R39 R40 R43 R44 R47 R48 R51 R52 = Diode: LatestRevisionDate: 03.04.2019; Publisher: ICT Berufsbildungscenter AG
R41 R42 R45 R46 R49 R50 R53 R54 = Resistor: LatestRevisionDate: 02.04.2019; Publisher: ICT Berufsbildungscenter AG

## Nets that join several sheets
+5V: Speisung (15 pins), USB Power (36 pins), AC Plug Power (16 pins)
+9V: Speisung (C3.A L2.2 R2.2), DC Power (24 pins)
+12V: Speisung (5 pins), USB Power (K7.1)
GND: Speisung (31 pins), USB Power (44 pins), DC Power (40 pins), AC Plug Power (8 pins)
L: Speisung (X2.2), AC Plug Power (8 pins)
N: Speisung (X2.1), AC Plug Power (8 pins)
NetK1_4: Speisung (K1.4), USB Power (Q8.3)
NetK1_5: Speisung (K1.5), USB Power (Q7.3)
NetK1_6: Speisung (K1.6), USB Power (Q6.3)
NetK1_7: Speisung (K1.7), USB Power (Q5.3)
NetK1_8: Speisung (K1.8), USB Power (Q4.3)
NetK1_9: Speisung (K1.9), USB Power (Q3.3)
NetK1_10: Speisung (K1.10), USB Power (Q2.3)
NetK1_11: Speisung (K1.11), USB Power (Q1.3)
NetK1_13: Speisung (K1.13), USB Power (K6.4 R24.2)
NetK1_14: Speisung (K1.14), USB Power (K5.4 R23.2)
NetK1_15: Speisung (K1.15), USB Power (K4.4 R20.2)
NetK1_16: Speisung (K1.16), USB Power (K3.4 R19.2)
NetK1_17: Speisung (K1.17), USB Power (K7.15 R27.2)
NetK1_18: Speisung (K1.18), USB Power (K7.16 R28.2)
NetK1_19: Speisung (K1.19), USB Power (K7.17 R29.2)
NetK1_20: Speisung (K1.20), USB Power (K7.18 R30.2)
NetK2_4: Speisung (K2.4), DC Power (Q16.5)
NetK2_5: Speisung (K2.5), DC Power (Q15.5)
NetK2_6: Speisung (K2.6), DC Power (Q14.5)
NetK2_7: Speisung (K2.7), DC Power (Q13.5)
NetK2_8: Speisung (K2.8), DC Power (Q12.5)
NetK2_9: Speisung (K2.9), DC Power (Q11.5)
NetK2_10: Speisung (K2.10), DC Power (Q10.5)
NetK2_11: Speisung (K2.11), DC Power (Q9.5)
NetK2_13: Speisung (K2.13), AC Plug Power (R54.2)
NetK2_14: Speisung (K2.14), AC Plug Power (R53.1)
NetK2_15: Speisung (K2.15), AC Plug Power (R50.2)
NetK2_16: Speisung (K2.16), AC Plug Power (R49.1)
NetK2_17: Speisung (K2.17), AC Plug Power (R46.2)
NetK2_18: Speisung (K2.18), AC Plug Power (R45.1)
NetK2_19: Speisung (K2.19), AC Plug Power (R42.2)
NetK2_20: Speisung (K2.20), AC Plug Power (R41.1)
PE: Speisung (X2.3), AC Plug Power (8 pins)